# Altium schematic sheet as14120_x31_fpga_cypress.SchDoc
size A3
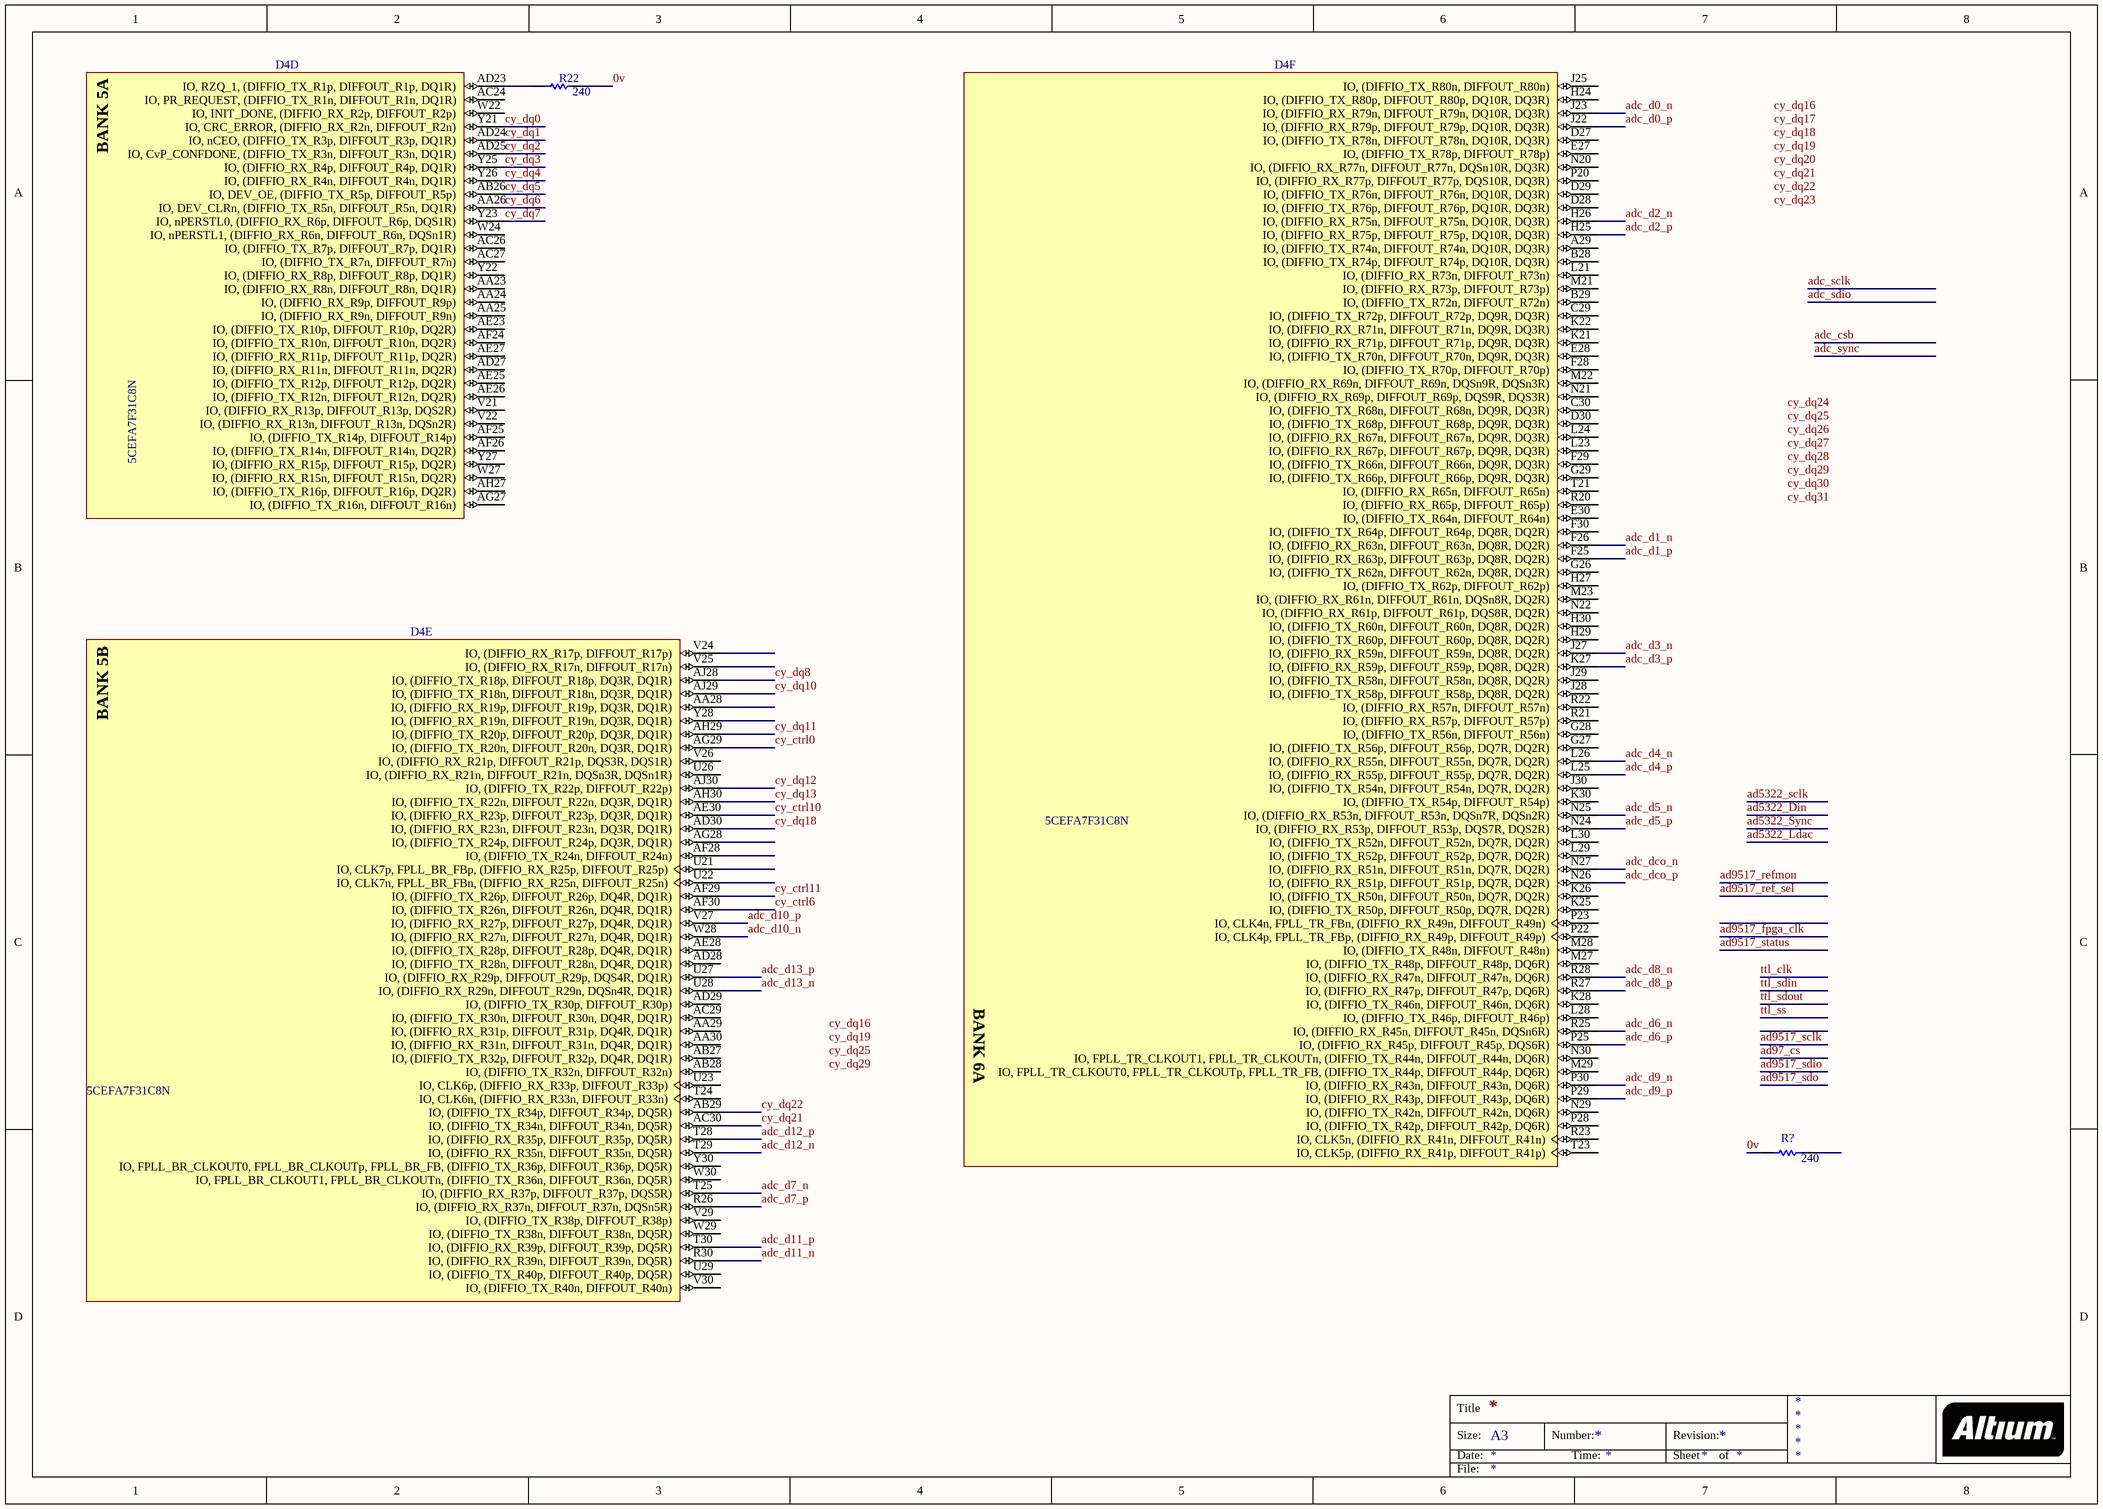
[diagram p0: as14120_x31_fpga_cypress.SchDoc]

## Parts
D4  5CEFA7F31C8N  [ALTR-896-FBGA-2000A]  (parts D,E,F of 13)
R22  240  [RESC0603(1608)_L]
R?  240  [RESC0603(1608)_L]

## Nets
0v: R22.2 R?.1
adc_d0_n: D4.J23(IO,_(DIFFIO_RX_R79n,_DIFFOUT_R79n,_DQ10R,_DQ3R))
adc_d0_p: D4.J22(IO,_(DIFFIO_RX_R79p,_DIFFOUT_R79p,_DQ10R,_DQ3R))
adc_d1_n: D4.F26(IO,_(DIFFIO_RX_R63n,_DIFFOUT_R63n,_DQ8R,_DQ2R))
adc_d1_p: D4.F25(IO,_(DIFFIO_RX_R63p,_DIFFOUT_R63p,_DQ8R,_DQ2R))
adc_d2_n: D4.H26(IO,_(DIFFIO_RX_R75n,_DIFFOUT_R75n,_DQ10R,_DQ3R))
adc_d2_p: D4.H25(IO,_(DIFFIO_RX_R75p,_DIFFOUT_R75p,_DQ10R,_DQ3R))
adc_d3_n: D4.J27(IO,_(DIFFIO_RX_R59n,_DIFFOUT_R59n,_DQ8R,_DQ2R))
adc_d3_p: D4.K27(IO,_(DIFFIO_RX_R59p,_DIFFOUT_R59p,_DQ8R,_DQ2R))
adc_d4_n: D4.L26(IO,_(DIFFIO_RX_R55n,_DIFFOUT_R55n,_DQ7R,_DQ2R))
adc_d4_p: D4.L25(IO,_(DIFFIO_RX_R55p,_DIFFOUT_R55p,_DQ7R,_DQ2R))
adc_d5_n: D4.N25(IO,_(DIFFIO_RX_R53n,_DIFFOUT_R53n,_DQSn7R,_DQSn2R))
adc_d5_p: D4.N24(IO,_(DIFFIO_RX_R53p,_DIFFOUT_R53p,_DQS7R,_DQS2R))
adc_d6_n: D4.R25(IO,_(DIFFIO_RX_R45n,_DIFFOUT_R45n,_DQSn6R))
adc_d6_p: D4.P25(IO,_(DIFFIO_RX_R45p,_DIFFOUT_R45p,_DQS6R))
adc_d7_n: D4.T25(IO,_(DIFFIO_RX_R37p,_DIFFOUT_R37p,_DQS5R))
adc_d7_p: D4.R26(IO,_(DIFFIO_RX_R37n,_DIFFOUT_R37n,_DQSn5R))
adc_d8_n: D4.R28(IO,_(DIFFIO_RX_R47n,_DIFFOUT_R47n,_DQ6R))
adc_d8_p: D4.R27(IO,_(DIFFIO_RX_R47p,_DIFFOUT_R47p,_DQ6R))
adc_d9_n: D4.P30(IO,_(DIFFIO_RX_R43n,_DIFFOUT_R43n,_DQ6R))
adc_d9_p: D4.P29(IO,_(DIFFIO_RX_R43p,_DIFFOUT_R43p,_DQ6R))
adc_d10_n: D4.W28(IO,_(DIFFIO_RX_R27n,_DIFFOUT_R27n,_DQ4R,_DQ1R))
adc_d10_p: D4.V27(IO,_(DIFFIO_RX_R27p,_DIFFOUT_R27p,_DQ4R,_DQ1R))
adc_d11_n: D4.R30(IO,_(DIFFIO_RX_R39n,_DIFFOUT_R39n,_DQ5R))
adc_d11_p: D4.T30(IO,_(DIFFIO_RX_R39p,_DIFFOUT_R39p,_DQ5R))
adc_d12_n: D4.T29(IO,_(DIFFIO_RX_R35n,_DIFFOUT_R35n,_DQ5R))
adc_d12_p: D4.T28(IO,_(DIFFIO_RX_R35p,_DIFFOUT_R35p,_DQ5R))
adc_d13_n: D4.U28(IO,_(DIFFIO_RX_R29n,_DIFFOUT_R29n,_DQSn4R,_DQ1R))
adc_d13_p: D4.U27(IO,_(DIFFIO_RX_R29p,_DIFFOUT_R29p,_DQS4R,_DQ1R))
adc_dco_n: D4.N27(IO,_(DIFFIO_RX_R51n,_DIFFOUT_R51n,_DQ7R,_DQ2R))
adc_dco_p: D4.N26(IO,_(DIFFIO_RX_R51p,_DIFFOUT_R51p,_DQ7R,_DQ2R))
cy_ctrl0: D4.AG29(IO,_(DIFFIO_TX_R20n,_DIFFOUT_R20n,_DQ3R,_DQ1R))
cy_ctrl6: D4.AF30(IO,_(DIFFIO_TX_R26n,_DIFFOUT_R26n,_DQ4R,_DQ1R))
cy_ctrl10: D4.AE30(IO,_(DIFFIO_RX_R23p,_DIFFOUT_R23p,_DQ3R,_DQ1R))
cy_ctrl11: D4.AF29(IO,_(DIFFIO_TX_R26p,_DIFFOUT_R26p,_DQ4R,_DQ1R))
cy_dq0: D4.Y21(IO,_CRC_ERROR,_(DIFFIO_RX_R2n,_DIFFOUT_R2n))
cy_dq1: D4.AD24(IO,_nCEO,_(DIFFIO_TX_R3p,_DIFFOUT_R3p,_DQ1R))
cy_dq2: D4.AD25(IO,_CvP_CONFDONE,_(DIFFIO_TX_R3n,_DIFFOUT_R3n,_DQ1R))
cy_dq3: D4.Y25(IO,_(DIFFIO_RX_R4p,_DIFFOUT_R4p,_DQ1R))
cy_dq4: D4.Y26(IO,_(DIFFIO_RX_R4n,_DIFFOUT_R4n,_DQ1R))
cy_dq5: D4.AB26(IO,_DEV_OE,_(DIFFIO_TX_R5p,_DIFFOUT_R5p))
cy_dq6: D4.AA26(IO,_DEV_CLRn,_(DIFFIO_TX_R5n,_DIFFOUT_R5n,_DQ1R))
cy_dq7: D4.Y23(IO,_nPERSTL0,_(DIFFIO_RX_R6p,_DIFFOUT_R6p,_DQS1R))
cy_dq8: D4.AJ28(IO,_(DIFFIO_TX_R18p,_DIFFOUT_R18p,_DQ3R,_DQ1R))
cy_dq10: D4.AJ29(IO,_(DIFFIO_TX_R18n,_DIFFOUT_R18n,_DQ3R,_DQ1R))
cy_dq11: D4.AH29(IO,_(DIFFIO_TX_R20p,_DIFFOUT_R20p,_DQ3R,_DQ1R))
cy_dq12: D4.AJ30(IO,_(DIFFIO_TX_R22p,_DIFFOUT_R22p))
cy_dq13: D4.AH30(IO,_(DIFFIO_TX_R22n,_DIFFOUT_R22n,_DQ3R,_DQ1R))
cy_dq18: D4.AD30(IO,_(DIFFIO_RX_R23n,_DIFFOUT_R23n,_DQ3R,_DQ1R))
cy_dq21: D4.AC30(IO,_(DIFFIO_TX_R34n,_DIFFOUT_R34n,_DQ5R))
cy_dq22: D4.AB29(IO,_(DIFFIO_TX_R34p,_DIFFOUT_R34p,_DQ5R))
NetD4_AD23: D4.AD23(IO,_RZQ_1,_(DIFFIO_TX_R1p,_DIFFOUT_R1p,_DQ1R)) R22.1

Not connected (* = marked no-connect by the designer): D4 A29(IO,_(DIFFIO_TX_R74n,_DIFFOUT_R74n,_DQ10R,_DQ3R)) AA23(IO,_(DIFFIO_RX_R8n,_DIFFOUT_R8n,_DQ1R)) AA24(IO,_(DIFFIO_RX_R9p,_DIFFOUT_R9p)) AA25(IO,_(DIFFIO_RX_R9n,_DIFFOUT_R9n)) AA28(IO,_(DIFFIO_RX_R19p,_DIFFOUT_R19p,_DQ3R,_DQ1R)) AA29(IO,_(DIFFIO_RX_R31p,_DIFFOUT_R31p,_DQ4R,_DQ1R)) AA30(IO,_(DIFFIO_RX_R31n,_DIFFOUT_R31n,_DQ4R,_DQ1R)) AB27(IO,_(DIFFIO_TX_R32p,_DIFFOUT_R32p,_DQ4R,_DQ1R)) AB28(IO,_(DIFFIO_TX_R32n,_DIFFOUT_R32n)) AC24(IO,_PR_REQUEST,_(DIFFIO_TX_R1n,_DIFFOUT_R1n,_DQ1R)) AC26(IO,_(DIFFIO_TX_R7p,_DIFFOUT_R7p,_DQ1R)) AC27(IO,_(DIFFIO_TX_R7n,_DIFFOUT_R7n)) AC29(IO,_(DIFFIO_TX_R30n,_DIFFOUT_R30n,_DQ4R,_DQ1R)) AD27(IO,_(DIFFIO_RX_R11n,_DIFFOUT_R11n,_DQ2R)) AD28(IO,_(DIFFIO_TX_R28n,_DIFFOUT_R28n,_DQ4R,_DQ1R)) AD29(IO,_(DIFFIO_TX_R30p,_DIFFOUT_R30p)) AE23(IO,_(DIFFIO_TX_R10p,_DIFFOUT_R10p,_DQ2R)) AE25(IO,_(DIFFIO_TX_R12p,_DIFFOUT_R12p,_DQ2R)) AE26(IO,_(DIFFIO_TX_R12n,_DIFFOUT_R12n,_DQ2R)) AE27(IO,_(DIFFIO_RX_R11p,_DIFFOUT_R11p,_DQ2R)) AE28(IO,_(DIFFIO_TX_R28p,_DIFFOUT_R28p,_DQ4R,_DQ1R)) AF24(IO,_(DIFFIO_TX_R10n,_DIFFOUT_R10n,_DQ2R)) AF25(IO,_(DIFFIO_TX_R14p,_DIFFOUT_R14p)) AF26(IO,_(DIFFIO_TX_R14n,_DIFFOUT_R14n,_DQ2R)) AF28(IO,_(DIFFIO_TX_R24n,_DIFFOUT_R24n)) AG27(IO,_(DIFFIO_TX_R16n,_DIFFOUT_R16n)) AG28(IO,_(DIFFIO_TX_R24p,_DIFFOUT_R24p,_DQ3R,_DQ1R)) AH27(IO,_(DIFFIO_TX_R16p,_DIFFOUT_R16p,_DQ2R)) B28(IO,_(DIFFIO_TX_R74p,_DIFFOUT_R74p,_DQ10R,_DQ3R)) B29(IO,_(DIFFIO_TX_R72n,_DIFFOUT_R72n)) C29(IO,_(DIFFIO_TX_R72p,_DIFFOUT_R72p,_DQ9R,_DQ3R)) C30(IO,_(DIFFIO_TX_R68n,_DIFFOUT_R68n,_DQ9R,_DQ3R)) D27(IO,_(DIFFIO_TX_R78n,_DIFFOUT_R78n,_DQ10R,_DQ3R)) D28(IO,_(DIFFIO_TX_R76p,_DIFFOUT_R76p,_DQ10R,_DQ3R)) D29(IO,_(DIFFIO_TX_R76n,_DIFFOUT_R76n,_DQ10R,_DQ3R)) D30(IO,_(DIFFIO_TX_R68p,_DIFFOUT_R68p,_DQ9R,_DQ3R)) E27(IO,_(DIFFIO_TX_R78p,_DIFFOUT_R78p)) E28(IO,_(DIFFIO_TX_R70n,_DIFFOUT_R70n,_DQ9R,_DQ3R)) E30(IO,_(DIFFIO_TX_R64n,_DIFFOUT_R64n)) F28(IO,_(DIFFIO_TX_R70p,_DIFFOUT_R70p)) F29(IO,_(DIFFIO_TX_R66n,_DIFFOUT_R66n,_DQ9R,_DQ3R)) F30(IO,_(DIFFIO_TX_R64p,_DIFFOUT_R64p,_DQ8R,_DQ2R)) G26(IO,_(DIFFIO_TX_R62n,_DIFFOUT_R62n,_DQ8R,_DQ2R)) G27(IO,_(DIFFIO_TX_R56p,_DIFFOUT_R56p,_DQ7R,_DQ2R)) G28(IO,_(DIFFIO_TX_R56n,_DIFFOUT_R56n)) G29(IO,_(DIFFIO_TX_R66p,_DIFFOUT_R66p,_DQ9R,_DQ3R)) H24(IO,_(DIFFIO_TX_R80p,_DIFFOUT_R80p,_DQ10R,_DQ3R)) H27(IO,_(DIFFIO_TX_R62p,_DIFFOUT_R62p)) H29(IO,_(DIFFIO_TX_R60p,_DIFFOUT_R60p,_DQ8R,_DQ2R)) H30(IO,_(DIFFIO_TX_R60n,_DIFFOUT_R60n,_DQ8R,_DQ2R)) J25(IO,_(DIFFIO_TX_R80n,_DIFFOUT_R80n)) J28(IO,_(DIFFIO_TX_R58p,_DIFFOUT_R58p,_DQ8R,_DQ2R)) J29(IO,_(DIFFIO_TX_R58n,_DIFFOUT_R58n,_DQ8R,_DQ2R)) J30(IO,_(DIFFIO_TX_R54n,_DIFFOUT_R54n,_DQ7R,_DQ2R)) K21(IO,_(DIFFIO_RX_R71p,_DIFFOUT_R71p,_DQ9R,_DQ3R)) K22(IO,_(DIFFIO_RX_R71n,_DIFFOUT_R71n,_DQ9R,_DQ3R)) K25(IO,_(DIFFIO_TX_R50p,_DIFFOUT_R50p,_DQ7R,_DQ2R)) K26(IO,_(DIFFIO_TX_R50n,_DIFFOUT_R50n,_DQ7R,_DQ2R)) K28(IO,_(DIFFIO_TX_R46n,_DIFFOUT_R46n,_DQ6R)) K30(IO,_(DIFFIO_TX_R54p,_DIFFOUT_R54p)) L21(IO,_(DIFFIO_RX_R73n,_DIFFOUT_R73n)) L23(IO,_(DIFFIO_RX_R67p,_DIFFOUT_R67p,_DQ9R,_DQ3R)) L24(IO,_(DIFFIO_RX_R67n,_DIFFOUT_R67n,_DQ9R,_DQ3R)) L28(IO,_(DIFFIO_TX_R46p,_DIFFOUT_R46p)) L29(IO,_(DIFFIO_TX_R52p,_DIFFOUT_R52p,_DQ7R,_DQ2R)) L30(IO,_(DIFFIO_TX_R52n,_DIFFOUT_R52n,_DQ7R,_DQ2R)) M21(IO,_(DIFFIO_RX_R73p,_DIFFOUT_R73p)) M22(IO,_(DIFFIO_RX_R69n,_DIFFOUT_R69n,_DQSn9R,_DQSn3R)) M23(IO,_(DIFFIO_RX_R61n,_DIFFOUT_R61n,_DQSn8R,_DQ2R)) M27(IO,_(DIFFIO_TX_R48p,_DIFFOUT_R48p,_DQ6R)) M28(IO,_(DIFFIO_TX_R48n,_DIFFOUT_R48n)) M29(IO,_FPLL_TR_CLKOUT0,_FPLL_TR_CLKOUTp,_FPLL_TR_FB,_(DIFFIO_TX_R44p,_DIFFOUT_R44p,_DQ6R)) N20(IO,_(DIFFIO_RX_R77n,_DIFFOUT_R77n,_DQSn10R,_DQ3R)) N21(IO,_(DIFFIO_RX_R69p,_DIFFOUT_R69p,_DQS9R,_DQS3R)) N22(IO,_(DIFFIO_RX_R61p,_DIFFOUT_R61p,_DQS8R,_DQ2R)) N29(IO,_(DIFFIO_TX_R42n,_DIFFOUT_R42n,_DQ6R)) N30(IO,_FPLL_TR_CLKOUT1,_FPLL_TR_CLKOUTn,_(DIFFIO_TX_R44n,_DIFFOUT_R44n,_DQ6R)) P20(IO,_(DIFFIO_RX_R77p,_DIFFOUT_R77p,_DQS10R,_DQ3R)) P22(IO,_CLK4p,_FPLL_TR_FBp,_(DIFFIO_RX_R49p,_DIFFOUT_R49p)) P23(IO,_CLK4n,_FPLL_TR_FBn,_(DIFFIO_RX_R49n,_DIFFOUT_R49n)) P28(IO,_(DIFFIO_TX_R42p,_DIFFOUT_R42p,_DQ6R)) R20(IO,_(DIFFIO_RX_R65p,_DIFFOUT_R65p)) R21(IO,_(DIFFIO_RX_R57p,_DIFFOUT_R57p)) R22(IO,_(DIFFIO_RX_R57n,_DIFFOUT_R57n)) R23(IO,_CLK5n,_(DIFFIO_RX_R41n,_DIFFOUT_R41n)) T21(IO,_(DIFFIO_RX_R65n,_DIFFOUT_R65n)) T23(IO,_CLK5p,_(DIFFIO_RX_R41p,_DIFFOUT_R41p)) T24(IO,_CLK6n,_(DIFFIO_RX_R33n,_DIFFOUT_R33n)) U21(IO,_CLK7p,_FPLL_BR_FBp,_(DIFFIO_RX_R25p,_DIFFOUT_R25p)) U22(IO,_CLK7n,_FPLL_BR_FBn,_(DIFFIO_RX_R25n,_DIFFOUT_R25n)) U23(IO,_CLK6p,_(DIFFIO_RX_R33p,_DIFFOUT_R33p)) U26(IO,_(DIFFIO_RX_R21n,_DIFFOUT_R21n,_DQSn3R,_DQSn1R)) U29(IO,_(DIFFIO_TX_R40p,_DIFFOUT_R40p,_DQ5R)) V21(IO,_(DIFFIO_RX_R13p,_DIFFOUT_R13p,_DQS2R)) V22(IO,_(DIFFIO_RX_R13n,_DIFFOUT_R13n,_DQSn2R)) V24(IO,_(DIFFIO_RX_R17p,_DIFFOUT_R17p)) V25(IO,_(DIFFIO_RX_R17n,_DIFFOUT_R17n)) V26(IO,_(DIFFIO_RX_R21p,_DIFFOUT_R21p,_DQS3R,_DQS1R)) V29(IO,_(DIFFIO_TX_R38p,_DIFFOUT_R38p)) V30(IO,_(DIFFIO_TX_R40n,_DIFFOUT_R40n)) W22(IO,_INIT_DONE,_(DIFFIO_RX_R2p,_DIFFOUT_R2p)) W24(IO,_nPERSTL1,_(DIFFIO_RX_R6n,_DIFFOUT_R6n,_DQSn1R)) W27(IO,_(DIFFIO_RX_R15n,_DIFFOUT_R15n,_DQ2R)) W29(IO,_(DIFFIO_TX_R38n,_DIFFOUT_R38n,_DQ5R)) W30(IO,_FPLL_BR_CLKOUT1,_FPLL_BR_CLKOUTn,_(DIFFIO_TX_R36n,_DIFFOUT_R36n,_DQ5R)) Y22(IO,_(DIFFIO_RX_R8p,_DIFFOUT_R8p,_DQ1R)) Y27(IO,_(DIFFIO_RX_R15p,_DIFFOUT_R15p,_DQ2R)) Y28(IO,_(DIFFIO_RX_R19n,_DIFFOUT_R19n,_DQ3R,_DQ1R)) Y30(IO,_FPLL_BR_CLKOUT0,_FPLL_BR_CLKOUTp,_FPLL_BR_FB,_(DIFFIO_TX_R36p,_DIFFOUT_R36p,_DQ5R)); R? 2

## Notes on the sheet
- Labels drawn without touching a wire or pin: cy_dq16, cy_dq17, cy_dq18, cy_dq19, cy_dq20, cy_dq21, cy_dq22, cy_dq23, cy_dq24, cy_dq25, cy_dq26, cy_dq27, cy_dq28, cy_dq29, cy_dq30, cy_dq31
- Title
- Size:
- Date:
- A3
- Number:
- Time:
- Revision:
- Sheet
- of
- File:
- (in symbol 5CEFA7F31C8N, part D) BANK 5A
- (in symbol 5CEFA7F31C8N, part E) BANK 5B
- (in symbol 5CEFA7F31C8N, part F) BANK 6A

## Library data of the parts
D4 = 5CEFA7F31C8N: Cyclone V E Family FPGA, 1.07 to 1.13 V Supply, 480 I/O Pins, 7 PLLs, 896-Pin FBGA, Speed Grade 8, Commercial Grade, RoHS Compliant; Manufacturer: Altera; Device Group: 5CEFA7; GPIO: 480; Logic Elements (LE) (K): 149.5; Speed Grade: 8; DatasheetVersion: Rev. 3.1; PackageReference: 896-FBGA-2000A; PackageDescription: 896-Pin FineLine Ball-Grid Array (FBGA), Body 31 x 31 mm, Pitch 1 mm; Supplier 1: Digi-Key; Supplier Part Number 1: 544-2768-ND; Supplier 2: Mouser; Supplier Part Number 2: 989-5CEFA7F31C8N; RoHS: RoHS Compliant; Subcategory: Cyclone V E; Voltage Supply: 1.07 to 1.13 V; Mounting Technology: Surface Mount; Code_JEDEC: MS-034-AAN-1; PartNumber: 5CEFA7F31C8N; ComponentLink1Description: Manufacturer URL; ComponentLink1URL: http://www.altera.com; ComponentLink2Description: Datasheet; ComponentLink2URL: http://www.altera.com/literature/hb/cyclone-v/cv_51002.pdf; ComponentLink3Description: Package Specification; ComponentLink3URL: http://www.altera.com/devicepackaging/04R00435-01.pdf; ComponentLink4Description: Device Handbook URL; ComponentLink4URL: http://www.altera.com/literature/hb/cyclone-v/cyclone5_handbook.pdf; ComponentLink5Description: Device Overview URL; ComponentLink5URL: http://www.altera.com/literature/hb/cyclone-v/cv_51001.pdf; ComponentLink6Description: Device Pin-Out URL; ComponentLink6URL: http://www.altera.com/literature/dp/cyclone-v/1.1.txt; ComponentLink7Description: Product URL; ComponentLink7URL: http://www.buyaltera.com/scripts/partsearch.dll?Detail&name=5CEFA7F31C8N-ND
R22 R? = RES_0603: 1K 0.1W 5% 0603 (1608 Metric)  SMD; Case-EIA: 0603; Case-Metric: 1608; Technology: SMT; Value: 240; Tolerance: 5 %; Power: 0.1 W